# Altium schematic sheet [01] - Block Diagram.SchDoc: =ProjectName
size A4; CheckedBy: Ven; Author: Ven; CompanyName: HUST; Revision: V.1.0
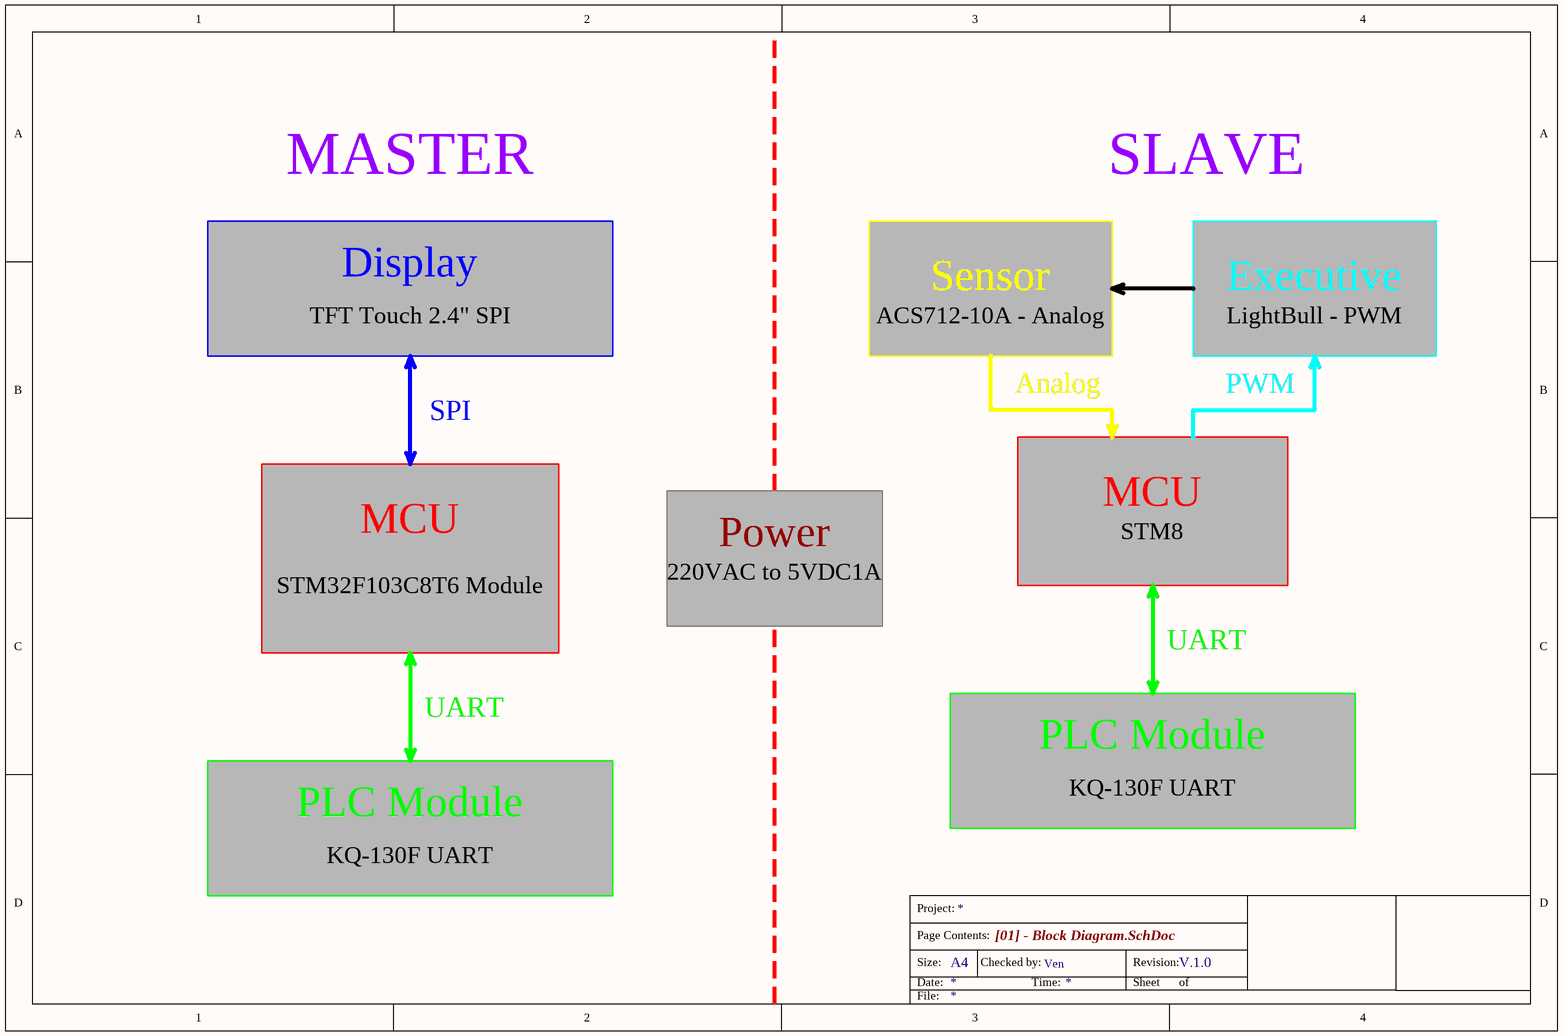
[diagram p0: [01] - Block Diagram.SchDoc]

## Notes on the sheet
- MASTER
- SLAVE
- Display
- TFT Touch 2.4" SPI
- Sensor
- ACS712-10A - Analog
- Executive
- LightBull - PWM
- Analog
- PWM
- SPI
- MCU
- STM32F103C8T6 Module
- Power
- 220VAC to 5VDC1A
- STM8
- UART
- PLC Module
- KQ-130F UART
- Project:
- Page Contents:
- Size:
- Date:
- A4
- Checked by:
- Time:
- Revision:
- Sheet
- of
- File: